# Altium schematic sheet RoketAnaSistemSematik.SchDoc
size A4
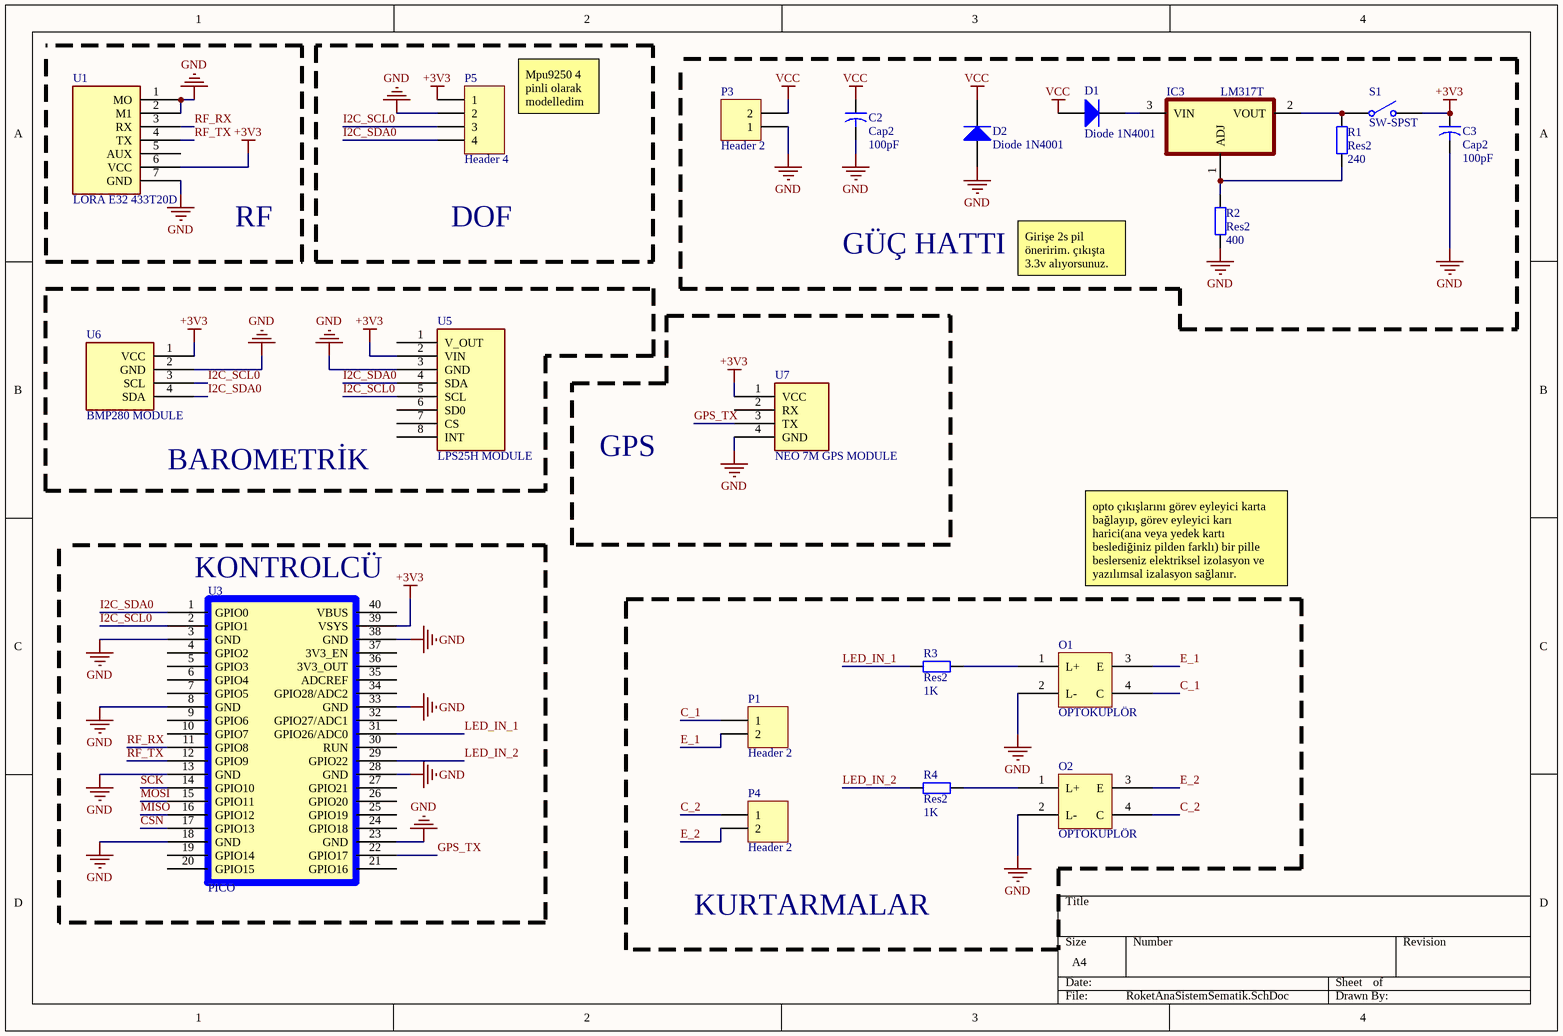
[diagram p0: RoketAnaSistemSematik.SchDoc]

## Parts
C2  Cap2  value 100pF  [CAPR5-4X5]
C3  Cap2  value 100pF  [CAPR5-4X5]
D1  Diode 1N4001  [DO-41]
D2  Diode 1N4001  [DO-41]
IC3  LM317T  [LM317]
O1  OPTOKUPLÖR  [OPTOKUPLÖR]
O2  OPTOKUPLÖR  [OPTOKUPLÖR]
P1  Header 2  [HDR1X2]
P3  Header 2  [HDR1X2]
P4  Header 2  [HDR1X2]
P5  Header 4  [HDR1X4]
R1  Res2  value 240  [AXIAL-0.4]
R2  Res2  value 400  [AXIAL-0.4]
R3  Res2  value 1K  [AXIAL-0.4]
R4  Res2  value 1K  [AXIAL-0.4]
S1  SW-SPST  [SPST-2]
U1  LORA E32 433T20D  [LORA E32 433T20D]
U3  PICO  [RASSBERY PI PICO]
U5  LPS25H MODULE  [LPS25H SENSOR]
U6  BMP280 MODULE  [BMP280 MODULE]
U7  NEO 7M GPS MODULE  [NEO 7M GPS MODULE]

## Blocks framed on the sheet
DOF: P5
BAROMETRİK: U5 U6
GPS: U7
KURTARMALAR: O1 O2 P1 P4 R3 R4

## Nets
+3V3: C3.1 P5.1 S1.2(NO) U1.6(VCC) U3.39(VSYS) U5.2(VIN) U6.1(VCC) U7.1(VCC)
GND: C2.2 C3.2 D2.1(A) O1.2(L-) O2.2(L-) P3.1 P5.2 R2.2 U1.1(MO) U1.2(M1) U1.7(GND) U3.3(GND) U3.8(GND) U3.13(GND) U3.18(GND) U3.23(GND) U3.28(GND) U3.33(GND) U3.38(GND) U5.3(GND) U6.2(GND) U7.4(GND)
VCC: C2.1 D1.1(A) D2.2(K) P3.2
C_1: O1.4(C) P1.1
C_2: O2.4(C) P4.1
CSN: U3.17(GPIO13)
E_1: O1.3(E) P1.2
E_2: O2.3(E) P4.2
GPS_TX: U3.22(GPIO17) U7.3(TX)
I2C_SCL0: P5.3 U3.2(GPIO1) U5.5(SCL) U6.3(SCL)
I2C_SDA0: P5.4 U3.1(GPIO0) U5.4(SDA) U6.4(SDA)
LED_IN_1: R3.2 U3.31(GPIO26/ADC0)
LED_IN_2: R4.2 U3.29(GPIO22)
MISO: U3.16(GPIO12)
MOSI: U3.15(GPIO11)
RF_RX: U1.3(RX) U3.11(GPIO8)
RF_TX: U1.4(TX) U3.12(GPIO9)
SCK: U3.14(GPIO10)
NetD1_2: D1.2(K) IC3.3(VIN)
NetIC3_1: IC3.1(ADJ) R1.1 R2.1
NetIC3_2: IC3.2(VOUT) R1.2 S1.1(COMMON)
NetO1_1: O1.1(L+) R3.1
NetO2_1: O2.1(L+) R4.1

Not connected (* = marked no-connect by the designer): U1 5(AUX); U3 4(GPIO2) 5(GPIO3) 6(GPIO4) 7(GPIO5) 9(GPIO6) 10(GPIO7) 19(GPIO14) 20(GPIO15) 21(GPIO16) 24(GPIO18) 25(GPIO19) 26(GPIO20) 27(GPIO21) 30(RUN) 32(GPIO27/ADC1) 34(GPIO28/ADC2) 35(ADCREF) 36(3V3_OUT) 37(3V3_EN) 40(VBUS); U5 1(V_OUT) 6(SD0) 7(CS) 8(INT); U7 2(RX)

## Notes on the sheet
- Mpu9250 4 pinli olarak modelledim
- RF
- GÜÇ HATTI
- Girişe 2s pil öneririm. çıkışta 3.3v alıyorsunuz.
- (near U3) KONTROLCÜ
- opto çıkışlarını görev eyleyici karta bağlayıp, görev eyleyici karı harici(ana veya yedek kartı beslediğiniz pilden farklı) bir pille beslerseniz elektriksel izolasyon ve yazılımsal izalasyon sağlanır.

## Library data of the parts
C2 C3 = Cap2: Capacitor; Published: 23-Sep-2002; PackageReference: CAPR5-4X5; Publisher: Altium Limited; PackageDescription: Capacitor; 2 Leads
D1 D2 = Diode 1N4001: 1 Amp General Purpose Rectifier; Published: 8-Jun-2000; LatestRevisionDate: 17-Jul-2002; LatestRevisionNote: Re-released for DXP Platform.; DatasheetVersion: 1998; PackageVersion: Aug-1999; PackageReference: DO-41; Publisher: Altium Limited; PackageDescription: Diode, Axial; Body 5.2 x 2.7 mm (LxDia. max), Lead Dia. 0.86 mm (max); Code_JEDEC: DO-204-AL; ComponentLink1Description: Manufacturer Link; ComponentLink1URL: http://www.fairchildsemi.com/; ComponentLink2Description: Datasheet; ComponentLink2URL: http://www.fairchildsemi.com/ds/1N%2F1N4001.pdf
IC3 = LM317T: 1.5-A, 40-V, adjustable linear voltage regulator 3-TO-220; MF: Texas Instruments; Arrow_Electronics-Purchase-URL: https://snapeda.com/shop?store=Arrow+Electronics&id=2756289; Price: None; Value: *; Availability: Unavailable; DigiKey-Purchase-URL: https://snapeda.com/shop?store=DigiKey&id=2756289; Mouser-Purchase-URL: https://snapeda.com/shop?store=Mouser&id=2756289; SnapEDA_Link: https://www.snapeda.com/parts/LM317T/Texas%20Instruments/view-part/2756289/?ref=snap; MP: LM317T; Package: TO-220-3 Texas Instruments
P1 P3 P4 = Header 2: Header, 2-Pin; LatestRevisionDate: 17-Jul-2002; LatestRevisionNote: Re-released for DXP Platform.; Publisher: Altium Limited
P5 = Header 4: Header, 4-Pin; LatestRevisionDate: 17-Jul-2002; LatestRevisionNote: Re-released for DXP Platform.; Publisher: Altium Limited
R1-R4 = Res2: Resistor; Published: 8-Jun-2000; LatestRevisionDate: 17-Jul-2002; LatestRevisionNote: Re-released for DXP Platform.; PackageReference: AXIAL-0.4; Publisher: Altium Limited; PackageDescription: Axial Device, Thru-Hole; 2 Leads; 0.4 in Pin Spacing
S1 = SW-SPST: Single-Pole, Single-Throw Switch; Published: 24-Mar-1999; LatestRevisionDate: 17-Jul-2002; LatestRevisionNote: Re-released for DXP Platform.; PackageReference: SPST-2; Publisher: Altium Limited; PackageDescription: Switch; 2 Leads
U1 = LORA E32 433T20D: LORA E32 433T20D RF MODULE
U3 = Rasspberry Pi Pico: 133MHz MICROCONTROLLER
U5 = LPS25H MODULE: ALTITUDE, PRESSURE SENSOR MODULE
U6 = BMP280 MODULE: PRESSURE,ALTITUDE SENSOR MODULE